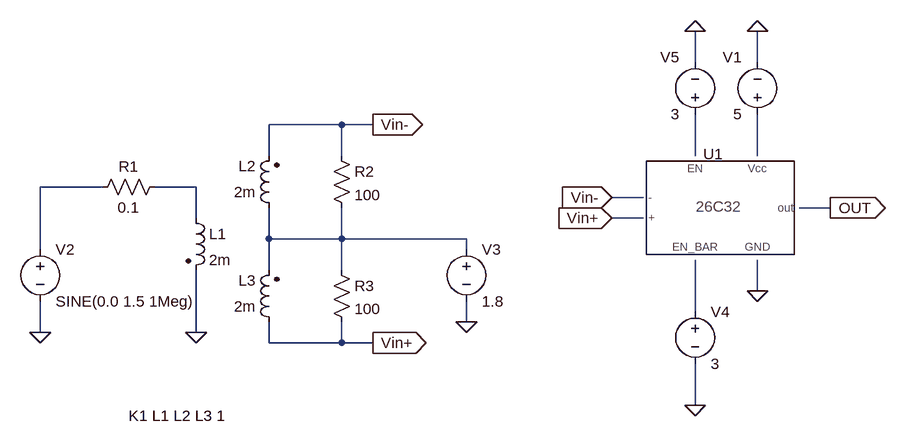
[diagram p0: schematic 26C32_test.asc]
26C32_test.asc, the LTspice schematic file:
Version 4
SHEET 1 880 680
WIRE 528 -80 528 -128
WIRE 624 -80 624 -128
WIRE -16 16 -128 16
WIRE 32 16 -16 16
WIRE -128 64 -128 16
WIRE -16 64 -16 16
WIRE 528 64 528 0
WIRE 624 64 624 0
WIRE -384 112 -480 112
WIRE -240 112 -304 112
WIRE 448 128 400 128
WIRE 736 144 688 144
WIRE -240 160 -240 112
WIRE 448 160 400 160
WIRE -128 192 -128 144
WIRE -16 192 -16 144
WIRE -16 192 -128 192
WIRE 176 192 -16 192
WIRE -480 208 -480 112
WIRE 176 208 176 192
WIRE -128 240 -128 192
WIRE -16 240 -16 192
WIRE 624 272 624 224
WIRE 528 304 528 224
WIRE 176 320 176 288
WIRE -480 336 -480 288
WIRE -240 336 -240 240
WIRE -128 352 -128 320
WIRE -16 352 -16 320
WIRE -16 352 -128 352
WIRE 32 352 -16 352
WIRE 528 448 528 384
FLAG 624 272 0
FLAG 624 -128 0
FLAG 736 144 OUT
IOPIN 736 144 Out
FLAG -480 336 0
FLAG -240 336 0
FLAG 32 16 Vin-
IOPIN 32 16 Out
FLAG 32 352 Vin+
IOPIN 32 352 Out
FLAG 400 128 Vin-
IOPIN 400 128 In
FLAG 400 160 Vin+
IOPIN 400 160 In
FLAG 176 320 0
FLAG 528 -128 0
FLAG 528 448 0
SYMBOL 26C32 528 144 R0
SYMATTR InstName U1
SYMBOL voltage 624 16 R180
WINDOW 0 24 104 Left 0
WINDOW 3 24 16 Left 0
WINDOW 123 0 0 Left 0
WINDOW 39 0 0 Left 0
SYMATTR InstName V1
SYMATTR Value 5
SYMBOL voltage -480 192 R0
WINDOW 123 0 0 Left 0
WINDOW 39 0 0 Left 0
SYMATTR InstName V2
SYMATTR Value SINE(0.0 1.5 1Meg)
SYMBOL res -400 128 R270
WINDOW 0 32 56 VTop 0
WINDOW 3 0 56 VBottom 0
SYMATTR InstName R1
SYMATTR Value 0.1
SYMBOL ind2 -256 144 R0
SYMATTR InstName L1
SYMATTR Value 2m
SYMATTR Type ind
SYMBOL ind2 -112 160 R180
WINDOW 0 36 80 Left 0
WINDOW 3 36 40 Left 0
SYMATTR InstName L2
SYMATTR Value 2m
SYMATTR Type ind
SYMBOL ind2 -112 336 R180
WINDOW 0 36 80 Left 0
WINDOW 3 36 40 Left 0
SYMATTR InstName L3
SYMATTR Value 2m
SYMATTR Type ind
SYMBOL res -32 48 R0
SYMATTR InstName R2
SYMATTR Value 100
SYMBOL res -32 224 R0
SYMATTR InstName R3
SYMATTR Value 100
SYMBOL voltage 176 192 R0
WINDOW 123 0 0 Left 0
WINDOW 39 0 0 Left 0
SYMATTR InstName V3
SYMATTR Value 1.8
SYMBOL voltage 528 288 R0
WINDOW 123 0 0 Left 0
WINDOW 39 0 0 Left 0
SYMATTR InstName V4
SYMATTR Value 3
SYMBOL voltage 528 16 R180
WINDOW 0 24 104 Left 0
WINDOW 3 24 16 Left 0
WINDOW 123 0 0 Left 0
WINDOW 39 0 0 Left 0
SYMATTR InstName V5
SYMATTR Value 3
TEXT -344 464 Left 0 !K1 L1 L2 L3 1

The netlist it stands for:
* 26C32_test.asc
XU1 Vin- Vin+ OUT N001 N006 N002 0 26C32  ; pins - + out EN EN_BAR Vcc GND
V1 N002 0 5
V2 N003 0 SINE(0.0 1.5 1Meg)
R1 N003 N004 0.1
L1 N004 0 2m
L2 N005 Vin- 2m
L3 Vin+ N005 2m
R2 Vin- N005 100
R3 N005 Vin+ 100
V3 N005 0 1.8
V4 N006 0 3
V5 N001 0 3
K1 L1 L2 L3 1
.lib receiver26C32_MOD.txt
.backanno
.end